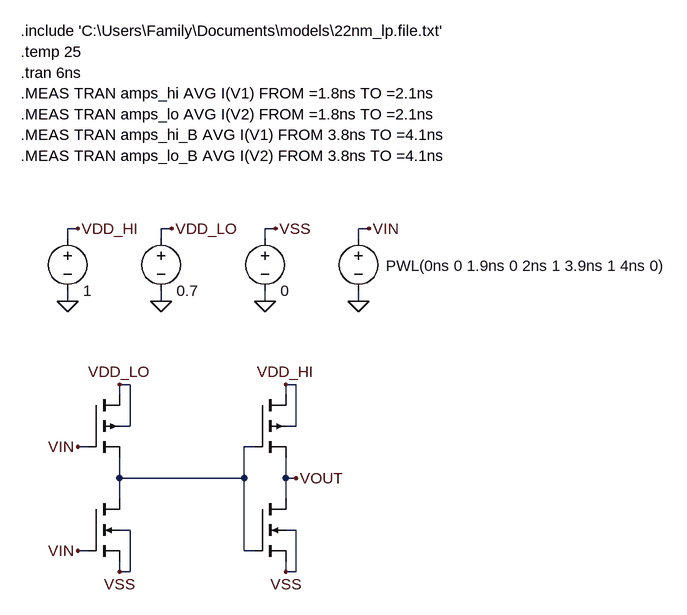
[diagram p0: schematic Q1.asc]
Q1.asc, the LTspice schematic file:
Version 4
SHEET 1 1132 680
WIRE 16 16 0 16
WIRE 160 16 144 16
WIRE 320 16 304 16
WIRE 464 16 448 16
WIRE 0 32 0 16
WIRE 144 32 144 16
WIRE 304 32 304 16
WIRE 448 32 448 16
WIRE 0 128 0 112
WIRE 144 128 144 112
WIRE 304 128 304 112
WIRE 448 128 448 112
WIRE 96 256 80 256
WIRE 352 256 336 256
WIRE 80 272 80 256
WIRE 336 272 336 256
WIRE 96 320 96 256
WIRE 96 320 80 320
WIRE 352 320 352 256
WIRE 352 320 336 320
WIRE 32 352 16 352
WIRE 288 352 272 352
WIRE 80 400 80 368
WIRE 272 400 272 352
WIRE 272 400 80 400
WIRE 336 400 336 368
WIRE 352 400 336 400
WIRE 80 432 80 400
WIRE 336 432 336 400
WIRE 96 480 80 480
WIRE 352 480 336 480
WIRE 32 512 16 512
WIRE 272 512 272 400
WIRE 288 512 272 512
WIRE 80 544 80 528
WIRE 96 544 96 480
WIRE 96 544 80 544
WIRE 336 544 336 528
WIRE 352 544 352 480
WIRE 352 544 336 544
FLAG 0 128 0
FLAG 144 128 0
FLAG 448 128 0
FLAG 304 128 0
FLAG 16 16 VDD_HI
FLAG 160 16 VDD_LO
FLAG 464 16 VIN
FLAG 320 16 VSS
FLAG 80 544 VSS
FLAG 16 352 VIN
FLAG 16 512 VIN
FLAG 80 256 VDD_LO
FLAG 336 256 VDD_HI
FLAG 336 544 VSS
FLAG 352 400 VOUT
SYMBOL pmos4 32 272 R0
WINDOW 0 56 32 Invisible 2
WINDOW 3 56 72 Invisible 2
SYMATTR InstName M1
SYMATTR Value2 l=0.03u w=1.4u
SYMBOL nmos4 32 432 R0
WINDOW 0 56 32 Invisible 2
WINDOW 3 56 72 Invisible 2
SYMATTR InstName M2
SYMATTR Value2 l=0.03u w=0.8u
SYMBOL voltage 0 16 R0
WINDOW 0 24 16 Invisible 2
SYMATTR InstName V1
SYMATTR Value 1
SYMBOL voltage 144 16 R0
WINDOW 0 24 16 Invisible 2
SYMATTR InstName V2
SYMATTR Value 0.7
SYMBOL voltage 448 16 R0
WINDOW 0 24 16 Invisible 2
WINDOW 3 42 57 Left 2
WINDOW 123 0 0 Left 2
WINDOW 39 0 0 Left 2
SYMATTR InstName V3
SYMATTR Value PWL(0ns 0 1.9ns 0 2ns 1 3.9ns 1 4ns 0)
SYMBOL voltage 304 16 R0
WINDOW 0 24 16 Invisible 2
SYMATTR InstName V4
SYMATTR Value 0
SYMBOL pmos4 288 272 R0
WINDOW 0 56 32 Invisible 2
WINDOW 3 56 72 Invisible 2
SYMATTR InstName M3
SYMATTR Value2 l=0.03u w=1.4u
SYMBOL nmos4 288 432 R0
WINDOW 0 56 32 Invisible 2
WINDOW 3 56 72 Invisible 2
SYMATTR InstName M4
SYMATTR Value2 l=0.03u w=0.8u
TEXT -72 -288 Left 2 !.include 'C:\\Users\\Family\\Documents\\models\\22nm_lp.file.txt'
TEXT -72 -256 Left 2 !.temp 25
TEXT -72 -224 Left 2 !.tran 6ns
TEXT -72 -192 Left 2 !.MEAS TRAN amps_hi AVG I(V1) FROM =1.8ns TO =2.1ns
TEXT -72 -96 Left 2 !.MEAS TRAN amps_lo_B AVG I(V2) FROM 3.8ns TO =4.1ns
TEXT -72 -160 Left 2 !.MEAS TRAN amps_lo AVG I(V2) FROM =1.8ns TO =2.1ns
TEXT -72 -128 Left 2 !.MEAS TRAN amps_hi_B AVG I(V1) FROM 3.8ns TO =4.1ns

The netlist it stands for:
* Q1.asc
M1 VDD_LO VIN N001 VDD_LO PMOS l=0.03u w=1.4u
M2 N001 VIN VSS VSS NMOS l=0.03u w=0.8u
V1 VDD_HI 0 1
V2 VDD_LO 0 0.7
V3 VIN 0 PWL(0ns 0 1.9ns 0 2ns 1 3.9ns 1 4ns 0)
V4 VSS 0 0
M3 VDD_HI N001 VOUT VDD_HI PMOS l=0.03u w=1.4u
M4 VOUT N001 VSS VSS NMOS l=0.03u w=0.8u
.model NMOS NMOS
.model PMOS PMOS
.lib standard.mos
.include 'C:\Users\Family\Documents\models\22nm_lp.file.txt'
.temp 25
.tran 6ns
.MEAS TRAN amps_hi AVG I(V1) FROM =1.8ns TO =2.1ns
.MEAS TRAN amps_lo_B AVG I(V2) FROM 3.8ns TO =4.1ns
.MEAS TRAN amps_lo AVG I(V2) FROM =1.8ns TO =2.1ns
.MEAS TRAN amps_hi_B AVG I(V1) FROM 3.8ns TO =4.1ns
.backanno
.end